# Altium schematic sheet 2_PMIC.schdoc
size 431 x 309 mm; Symbol: Sheet-Symbol_A4; Device: Sheet-Symbol_A4; Company: 嘉立创EDA; Version: V1.0; Page Size: A4; @Project Name: RK3568核心板; @Page Count: 14; @Update Date: 2024-10-11; @Create Date: 2024-10-08; @Schematic Name: Schematic1; @Page No: 2; @Page Name: PMIC; @Board Name: Board1; @Create Time: 10:48:32; @Update Time: 10:49:04; Width: 1655; Height: 1170; Region Start: 1; X Region Count: 6; Y Region Count: 4; Blade Width: 10; Title Block Position: 3
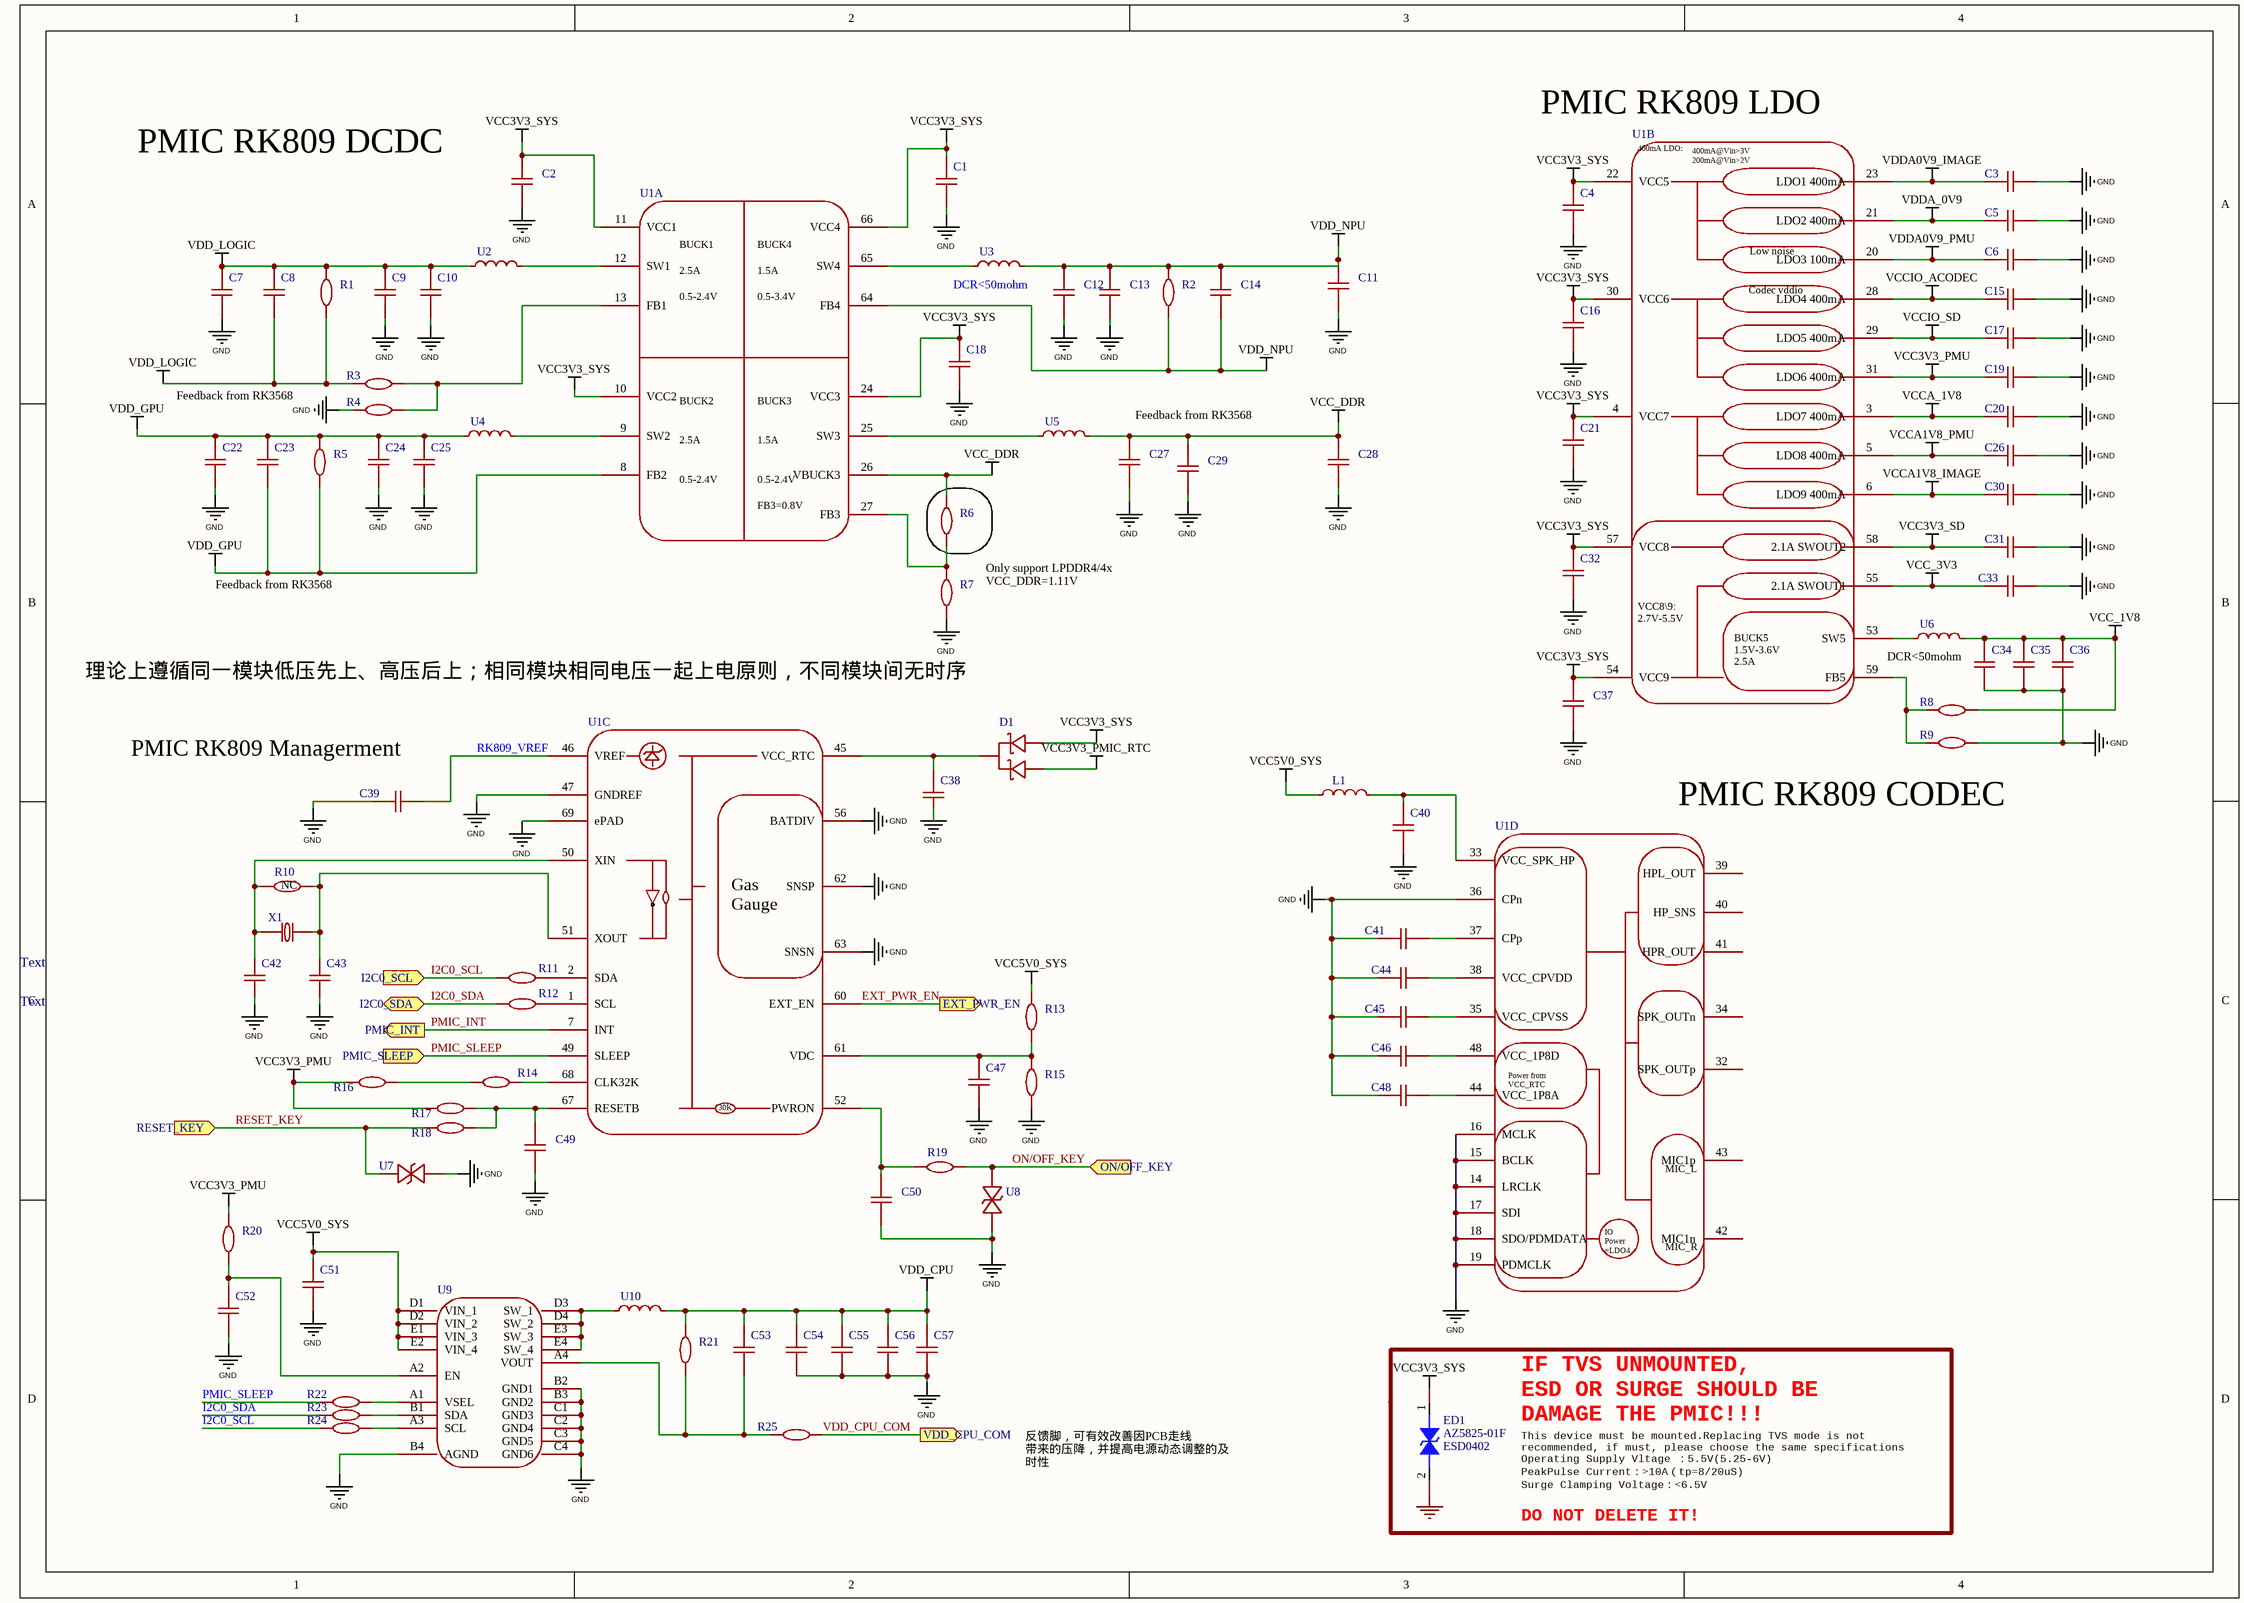
[diagram p0: 2_PMIC.schdoc]

## Parts
C1  10uF  [C0402]  (value not drawn)
C2  22uF  [C0603]  (value not drawn)
C3  1uF  [C0402]  (value not drawn)
C4  1uF  [C0402]  (value not drawn)
C5  1uF  [C0402]  (value not drawn)
C6  1uF  [C0402]  (value not drawn)
C7  10uF  [C0402]  (value not drawn)
C8  100nF  [C0402]  (value not drawn)
C9  22uF  [C0603]  (value not drawn)
C10  10uF  [C0402]  (value not drawn)
C11  10uF  [C0402]  (value not drawn)
C12  22uF  [C0603]  (value not drawn)
C13  10uF  [C0402]  (value not drawn)
C14  100nF  [C0402]  (value not drawn)
C15  1uF  [C0402]  (value not drawn)
C16  1uF  [C0402]  (value not drawn)
C17  1uF  [C0402]  (value not drawn)
C18  10uF  [C0402]  (value not drawn)
C19  1uF  [C0402]  (value not drawn)
C20  1uF  [C0402]  (value not drawn)
C21  1uF  [C0402]  (value not drawn)
C22  10uF  [C0402]  (value not drawn)
C23  100nF  [C0402]  (value not drawn)
C24  22uF  [C0603]  (value not drawn)
C25  10uF  [C0402]  (value not drawn)
C26  1uF  [C0402]  (value not drawn)
C27  22uF  [C0603]  (value not drawn)
C28  10uF  [C0402]  (value not drawn)
C29  10uF  [C0402]  (value not drawn)
C30  1uF  [C0402]  (value not drawn)
C31  1uF  [C0402]  (value not drawn)
C32  1uF  [C0402]  (value not drawn)
C33  10uF  [C0402]  (value not drawn)
C34  22uF  [C0603]  (value not drawn)
C35  22uF  [C0603]  (value not drawn)
C36  10uF  [C0402]  (value not drawn)
C37  10uF  [C0402]  (value not drawn)
C38  100nF  [C0402]  (value not drawn)
C39  1uF  [C0402]  (value not drawn)
C40  10uF  [C0402]  (value not drawn)
C41  2.2uF  [C0402]  (value not drawn)
C42  18pF  [C0402]  (value not drawn)
C43  18pF  [C0402]  (value not drawn)
C44  1uF  [C0402]  (value not drawn)
C45  2.2uF  [C0402]  (value not drawn)
C46  1uF  [C0402]  (value not drawn)
C47  100nF  [C0402]  (value not drawn)
C48  1uF  [C0402]  (value not drawn)
C49  100nF  [C0402]  (value not drawn)
C50  100nF  [C0402]  (value not drawn)
C51  22uF  [C0603]  (value not drawn)
C52  100nF  [C0402]  (value not drawn)
C53  100nF  [C0402]  (value not drawn)
C54  47uF  [C0805]  (value not drawn)
C55  22uF  [C0603]  (value not drawn)
C56  22uF  [C0603]  (value not drawn)
C57  22uF  [C0603]  (value not drawn)
D1  BAT54C,215  [SOT-23-3_L2.9-W1.6-P1.90-LS2.8-BR]  (value not drawn)
ED1  AZ5825-01F  [ESD0402]
L1  120R 100MHz  [L0603]  (value not drawn)
R1  100Ω  [R0402]  (value not drawn)
R2  100Ω  [R0402]  (value not drawn)
R3  560Ω  [R0402]  (value not drawn)
R4  9.1kΩ  [R0402]  (value not drawn)
R5  100Ω  [R0402]  (value not drawn)
R6  47kΩ  [R0402]  (value not drawn)
R7  120kΩ  [R0402]  (value not drawn)
R8  0Ω  [R0402]  (value not drawn)
R9  NC  [R0402]  (value not drawn)
R10  1MΩ  [R0402]  (value not drawn)
R11  22Ω  [R0402]  (value not drawn)
R12  22Ω  [R0402]  (value not drawn)
R13  180kΩ  [R0402]  (value not drawn)
R14  NC  [R0402]  (value not drawn)
R15  56kΩ  [R0402]  (value not drawn)
R16  10kΩ  [R0402]  (value not drawn)
R17  10kΩ  [R0402]  (value not drawn)
R18  22Ω  [R0402]  (value not drawn)
R19  100Ω  [R0402]  (value not drawn)
R20  51kΩ  [R0402]  (value not drawn)
R21  100Ω  [R0402]  (value not drawn)
R22  22Ω  [R0402]  (value not drawn)
R23  22Ω  [R0402]  (value not drawn)
R24  22Ω  [R0402]  (value not drawn)
R25  0Ω  [R0402]  (value not drawn)
U1  RK809-5  [RK809]  (value not drawn)  (parts A,B,C,D of 4)
U2  470nH  [IND-SMD_L2.0-W1.6]  (value not drawn)
U3  470nH  [IND-SMD_L2.0-W1.6]  (value not drawn)
U4  470nH  [IND-SMD_L2.0-W1.6]  (value not drawn)
U5  470nH  [IND-SMD_L2.0-W1.6]  (value not drawn)
U6  470nH  [IND-SMD_L2.0-W1.6]  (value not drawn)
U7  PESD3V3L1BA  [SOD-323_L1.7-W1.3-LS2.6-BI]  (value not drawn)
U8  PESD3V3L1BA  [SOD-323_L1.7-W1.3-LS2.6-BI]  (value not drawn)
U9  TCS4525  [TCS4525]  (value not drawn)
U10  240nH  [IND-SMD_L2.5-W2.0_MHCHL2520]  (value not drawn)
X1  32.768kHz  [FC-135R_L3.2-W1.5]  (value not drawn)

## Blocks framed on the sheet
DO NOT DELETE IT!: ED1

## Ports
EXT_PWR_EN (out), I2C0_SCL (in), I2C0_SDA (bidir), ON/OFF_KEY (in), PMIC_INT (out), PMIC_SLEEP (in), RESET_KEY (in), VDD_CPU_COM (out)

## Nets
GND: C1.1 C2.1 C3.2 C4.1 C5.2 C6.2 C7.1 C9.1 C10.1 C11.1 C12.1 C13.1 C15.2 C16.1 C17.2 C18.1 C19.2 C20.2 C21.1 C22.1 C24.1 C25.1 C26.2 C27.1 C28.1 C29.1 C30.2 C31.2 C32.1 C33.1 C34.1 C35.1 C36.1 C37.1 C38.1 C39.1 C40.1 C41.2 C42.1 C43.1 C44.1 C45.2 C46.1 C47.2 C48.1 C49.1 C50.2 C51.1 C52.1 C54.1 C55.1 C56.1 C57.1 ED1.2 R4.1 R7.1 R9.2 R15.2 U1.14(LRCLK) U1.15(BCLK) U1.16(MCLK) U1.17(SDI) U1.18(SDO/PDMDATA) U1.19(PDMCLK) U1.36(CPn) U1.47(GNDREF) U1.56(BATDIV) U1.62(SNSP) U1.63(SNSN) U1.69(ePAD) U7.2 U8.2 U9.B2(GND1) U9.B3(GND2) U9.B4(AGND) U9.C1(GND3) U9.C2(GND4) U9.C3(GND5) U9.C4(GND6)
VCC3V3_PMIC_RTC: D1.1(A)
VCC3V3_PMU: C19.1 R16.1 R17.1 R20.2 U1.31(LDO6_400mA)
VCC3V3_SD: C31.1 U1.58(2.1A_SWOUT2)
VCC3V3_SYS: C1.2 C2.2 C4.2 C16.2 C18.2 C21.2 C32.2 C37.2 D1.2(A) ED1.1 U1.4(VCC7) U1.10(VCC2) U1.11(VCC1) U1.22(VCC5) U1.24(VCC3) U1.30(VCC6) U1.54(VCC9) U1.57(VCC8) U1.66(VCC4)
VCC5V0_SYS: C51.2 L1.1 R13.2 U9.D1(VIN_1) U9.D2(VIN_2) U9.E1(VIN_3) U9.E2(VIN_4)
VCC_1V8: C34.2 C35.2 C36.2 R8.2 U6.2
VCC_3V3: C33.2 U1.55(2.1A_SWOUT1)
VCC_DDR: C27.2 C28.2 C29.2 R6.2 U1.26(VBUCK3) U5.1
VCCA1V8_IMAGE: C30.1 U1.6(LDO9_400mA)
VCCA1V8_PMU: C26.1 U1.5(LDO8_400mA)
VCCA_1V8: C20.1 U1.3(LDO7_400mA)
VCCIO_ACODEC: C15.1 U1.28(LDO4_400mA)
VCCIO_SD: C17.1 U1.29(LDO5_400mA)
VDD_CPU: C53.2 C54.2 C55.2 C56.2 C57.2 R21.2 U10.2
VDD_GPU: C22.2 C23.1 C23.2 C24.2 C25.2 R5.1 R5.2 U1.8(FB2) U4.1
VDD_LOGIC: C7.2 C8.1 C8.2 C9.2 C10.2 R1.1 R1.2 R3.2 U2.1
VDD_NPU: C11.2 C12.2 C13.2 C14.1 C14.2 R2.1 R2.2 U1.64(FB4) U3.1
VDDA0V9_IMAGE: C3.1 U1.23(LDO1_400mA)
VDDA0V9_PMU: C6.1 U1.20(LDO3_100mA)
VDDA_0V9: C5.1 U1.21(LDO2_400mA)
EXT_PWR_EN: U1.60(EXT_EN) ; port EXT_PWR_EN
I2C0_SCL: R11.2 R24.2 ; port I2C0_SCL
I2C0_SDA: R12.2 R23.2 ; port I2C0_SDA
ON/OFF_KEY: R19.2 U8.1 ; port ON/OFF_KEY
PMIC_INT: U1.7(INT) ; port PMIC_INT
PMIC_SLEEP: R22.2 U1.49(SLEEP) ; port PMIC_SLEEP
RESET_KEY: R18.1 U7.1 ; port RESET_KEY
RK809_VREF: C39.2 U1.46(VREF)
VDD_CPU_COM: R25.2 ; port VDD_CPU_COM
NetC38_2: C38.2 D1.3(K) U1.45(VCC_RTC)
NetC40_2: C40.2 L1.2 U1.33(VCC_SPK_HP)
NetC41_1: C41.1 U1.37(CPp)
NetC42_2: C42.2 R10.1 U1.50(XIN) X1.1
NetC43_2: C43.2 R10.2 U1.51(XOUT) X1.2
NetC44_2: C44.2 U1.38(VCC_CPVDD)
NetC45_1: C45.1 U1.35(VCC_CPVSS)
NetC46_2: C46.2 U1.48(VCC_1P8D)
NetC47_1: C47.1 R13.1 R15.1 U1.61(VDC)
NetC48_2: C48.2 U1.44(VCC_1P8A)
NetC49_2: C49.2 R17.2 R18.2 U1.67(RESETB)
NetC50_1: C50.1 R19.1 U1.52(PWRON)
NetC52_2: C52.2 R20.1 U9.A2(EN)
NetC53_1: C53.1 R21.1 R25.1 U9.A4(VOUT)
NetR3_1: R3.1 R4.2 U1.13(FB1)
NetR6_1: R6.1 R7.2 U1.27(FB3)
NetR8_1: R8.1 R9.1 U1.59(FB5)
NetR11_1: R11.1 U1.2(SDA)
NetR12_1: R12.1 U1.1(SCL)
NetR14_1: R14.1 U1.68(CLK32K)
NetR14_2: R14.2 R16.2
NetR22_1: R22.1 U9.A1(VSEL)
NetR23_1: R23.1 U9.B1(SDA)
NetR24_1: R24.1 U9.A3(SCL)
NetU1_9: U1.9(SW2) U4.2
NetU1_12: U1.12(SW1) U2.2
NetU1_25: U1.25(SW3) U5.2
NetU1_53: U1.53(SW5) U6.1
NetU1_65: U1.65(SW4) U3.2
NetU9_D3: U9.D3(SW_1) U9.D4(SW_2) U9.E3(SW_3) U9.E4(SW_4) U10.1

Not connected (* = marked no-connect by the designer): U1 32(SPK_OUTp) 34(SPK_OUTn) 39(HPL_OUT) 40(HP_SNS) 41(HPR_OUT) 42(MIC1n) 43(MIC1p)

## Notes on the sheet
- PMIC RK809 LDO
- PMIC RK809 DCDC
- (near U3) DCR<50mohm
- Feedback from RK3568
- 理论上遵循同一模块低压先上、高压后上；相同模块相同电压一起上电原则，不同模块间无时序
- Only support LPDDR4/4x
  VCC_DDR=1.11V
- (near U6) DCR<50mohm
- (near C39) PMIC RK809 Managerment
- PMIC RK809 CODEC
- (near R10) NC
- Text
- IF TVS UNMOUNTED,
  ESD OR SURGE SHOULD BE
  DAMAGE THE PMIC!!!
- 反馈脚，可有效改善因PCB走线
  带来的压降，并提高电源动态调整的及时性
- Operating Supply Vltage ：5.5V(5.25-6V)
- PeakPulse Current：>10A（tp=8/20uS)
- Surge Clamping Voltage：<6.5V
- This device must be mounted.Replacing TVS mode is not
  recommended, if must, please choose the same specifications
- 1
- 2
- 3
- 4
- 5
- 6
- A
- B
- C
- D
- 原理图
- Schematic1
- 创建日期
- 更新日期
- 2024-10-11
- 2024-10-08
- 审阅
- 绘制
- 图页
- PMIC
- 物料编码
- RK3568核心板
- 版本
- 尺寸
- 页
- 共
- 14
- V1.0
- A4
- 嘉立创EDA
- (in symbol RK809-5, part A) BUCK1; BUCK4; 2.5A; 1.5A; 0.5-2.4V; 0.5-3.4V; BUCK2; BUCK3; FB3=0.8V
- (in symbol RK809-5, part B) 400mA LDO:; Low noise; 400mA@Vin>3V / 200mA@Vin>2V; Codec vddio; VCC8\9: / 2.7V-5.5V; BUCK5 / 1.5V-3.6V / 2.5A
- (in symbol RK809-5, part C) Gas / Gauge; 30K
- (in symbol RK809-5, part D) MIC_L; Power from / VCC_RTC; MIC_R; IO / Power / =LDO4

## Library data of the parts
C1 C7 C10 C11 C13 C18 C22 C25 C28 C29 C33 C36 C37 C40 = CL05A106MP5NUNC: 容值:10uF;精度:±20%;额定电压:10V;材质(温度系数):X5R;; Manufacturer: SAMSUNG(三星); Symbol: CL05A106MP5NUNC_C315248; Add into BOM: yes; Tolerance: ±20%; Voltage Rated: 10V; Temperature Coefficient: X5R; Device: CL05A106MP5NUNC; LCSC Part Name: 10uF ±20% 10V; Supplier Part: C315248; Manufacturer Part: CL05A106MP5NUNC; Supplier Footprint: 0402; JLCPCB Part Class: 扩展库; Datasheet: https://atta.szlcsc.com/upload/public/pdf/source/20231220/1EF805BAE1520675928CC4638D279E74.pdf; Supplier: LCSC; Convert to PCB: yes; Value: 10uF
C2 = CGA0603X5R226M160JT: 容值:22uF;精度:±20%;额定电压:16V;材质(温度系数):X5R;; Manufacturer: HRE(芯声); Add into BOM: yes; Tolerance: ±20%; Voltage Rated: 16V; Temperature Coefficient: X5R; Symbol: CGA0603X5R226M160JT; Device: CGA0603X5R226M160JT; LCSC Part Name: 22uF ±20% 16V; Supplier Part: C6119868; Manufacturer Part: CGA0603X5R226M160JT; Supplier Footprint: 0603; JLCPCB Part Class: 扩展库; Supplier: LCSC; Convert to PCB: yes; Value: 22uF
C3-C6 C15-C17 C19-C21 C26 C30-C32 C39 C44 C46 C48 = CL05A105KA5NQNC: 容值:1uF;精度:±10%;额定电压:25V;材质(温度系数):X5R;; Manufacturer: SAMSUNG(三星); Add into BOM: yes; Tolerance: ±10%; Voltage Rated: 25V; Temperature Coefficient: X5R; Symbol: CL05A105KA5NQNC; Device: CL05A105KA5NQNC; LCSC Part Name: 1uF ±10% 25V; Supplier Part: C52923; Manufacturer Part: CL05A105KA5NQNC; Supplier Footprint: 0402; JLCPCB Part Class: 基础库; Datasheet: https://atta.szlcsc.com/upload/public/pdf/source/20160218/1457707763339.pdf; Supplier: LCSC; Convert to PCB: yes; Value: 1uF
C8 C14 C23 C38 C47 C49 C50 C52 C53 = CL05B104KB54PNC: 容值:100nF;精度:±10%;额定电压:50V;材质(温度系数):X7R;; Manufacturer: SAMSUNG(三星); Add into BOM: yes; Tolerance: ±10%; Voltage Rated: 50V; Temperature Coefficient: X7R; Symbol: CL05B104KB54PNC; Device: CL05B104KB54PNC; LCSC Part Name: 100nF ±10% 50V; Supplier Part: C307331; Manufacturer Part: CL05B104KB54PNC; Supplier Footprint: 0402; JLCPCB Part Class: 基础库; Datasheet: https://atta.szlcsc.com/upload/public/pdf/source/20160218/1457707763339.pdf; Supplier: LCSC; Convert to PCB: yes; Value: 100nF
C9 C12 C24 C27 C34 C35 C51 C55-C57 = CL10A226MP8NUNE: 容值:22uF;精度:±20%;额定电压:10V;材质(温度系数):X5R;; Manufacturer: SAMSUNG(三星); Add into BOM: yes; Tolerance: ±20%; Voltage Rated: 10V; Temperature Coefficient: X5R; Symbol: CL10A226MP8NUNE; Device: CL10A226MP8NUNE; LCSC Part Name: 22uF ±20% 10V; Supplier Part: C86295; Manufacturer Part: CL10A226MP8NUNE; Supplier Footprint: 0603; JLCPCB Part Class: 扩展库; Datasheet: https://atta.szlcsc.com/upload/public/pdf/source/20160218/1457707763339.pdf; Supplier: LCSC; Convert to PCB: yes; Value: 22uF
C41 C45 = GRM155R61E225KE11D: 容值:2.2uF;精度:±10%;额定电压:25V;材质(温度系数):X5R;; Manufacturer: muRata(村田); Add into BOM: yes; Tolerance: ±10%; Voltage Rated: 25V; Temperature Coefficient: X5R; Symbol: GRM155R61E225KE11D; Device: GRM155R61E225KE11D; LCSC Part Name: 2.2uF ±10% 25V; Supplier Part: C385032; Manufacturer Part: GRM155R61E225KE11D; Supplier Footprint: 0402; JLCPCB Part Class: 扩展库; Datasheet: https://atta.szlcsc.com/upload/public/pdf/source/20190531/C385032_AE390FF415271BC6A7223A7F56F516ED.pdf; Supplier: LCSC; Convert to PCB: yes; Value: 2.2uF
C42 C43 = 0402CG180J500NT: 容值:18pF;精度:±5%;额定电压:50V;材质(温度系数):C0G;; Manufacturer: FH(风华); Add into BOM: yes; Tolerance: ±5%; Voltage Rated: 50V; Temperature Coefficient: C0G; Symbol: 0402CG180J500NT; Device: 0402CG180J500NT; LCSC Part Name: 18pF ±5% 50V; Supplier Part: C1549; Manufacturer Part: 0402CG180J500NT; Supplier Footprint: 0402; JLCPCB Part Class: 基础库; Datasheet: https://atta.szlcsc.com/upload/public/pdf/source/20200305/C486355_26A10D38EF8C2A5C37091D0039909270.pdf; Supplier: LCSC; Convert to PCB: yes; Value: 18pF
C54 = CGA0805X5R476M100MT: 容值:47uF;精度:±20%;额定电压:10V;材质(温度系数):X5R;; Manufacturer: HRE(芯声); Add into BOM: yes; Tolerance: ±20%; Voltage Rated: 10V; Temperature Coefficient: X5R; Symbol: CGA0805X5R476M100MT; Device: CGA0805X5R476M100MT; LCSC Part Name: 47uF ±20% 10V; Supplier Part: C6119904; Manufacturer Part: CGA0805X5R476M100MT; Supplier Footprint: 0805; JLCPCB Part Class: 扩展库; Supplier: LCSC; Convert to PCB: yes; Value: 47uF
D1 = BAT54C,215: 二极管配置:1对共阴极;正向压降(Vf):800mV@100mA;直流反向耐压(Vr):30V;平均整流电流(Io):200mA;; Manufacturer: Nexperia(安世); Add into BOM: yes; Diode Configuration: 1对共阴极; Reverse Voltage (Vr): 30V; Average Rectified Current (Io): 200mA; Reverse Leakage Current (Ir): 2uA@25V; Symbol: BAT54C,215; Device: BAT54C,215; LCSC Part Name: 电压:30V 电流:200mA; Supplier Part: C37704; Manufacturer Part: BAT54C,215; Supplier Footprint: SOT-23; JLCPCB Part Class: 扩展库; Datasheet: https://atta.szlcsc.com/upload/public/pdf/source/20161024/1477288736847.pdf; Supplier: LCSC; Convert to PCB: yes; Forward Voltage (Vf@If): 800mV@100mA
ED1 = DIODE BI_DIR TRIG: Transient Voltage Suppressing Device.Tiny Packge for ESD/Transient Protection; Manufacturer: Amazing（晶焱科技）; Priority: A; PCB Footprint: ESD0402; Created by: JJJ; Manufacturer PN: AZ5825-01F; Part Type: ESD_TVS; RK PN: AZ5825-01F
L1 = BLM18PG121SN1D: 标称阻抗@测试频率:120Ω@100MHz;误差:±25%;直流电阻(RDC):50mΩ;; Manufacturer: muRata(村田); Symbol: BLM18PG121SN1D_C14709; Add into BOM: yes; Tolerance: ±25%; DC Resistance: 50mΩ; Current Rating: 2A; Circuits: 1; Device: BLM18PG121SN1D; LCSC Part Name: 单路 0603磁珠 阻抗120Ω@100MHz; Supplier Part: C14709; Manufacturer Part: 120R 100MHz; Supplier Footprint: 0603; JLCPCB Part Class: 扩展库; Datasheet: https://atta.szlcsc.com/upload/public/pdf/source/20130704/1457706621422.pdf; Supplier: LCSC; Convert to PCB: yes; Impedance @ Frequency: 120Ω@100MHz
R1 R2 R5 R19 R21 = 0402WGF1000TCE: 电阻类型:厚膜电阻;阻值:100Ω;精度:±1%;功率:62.5mW;最大工作电压:50V;温度系数:±200ppm/℃;; Manufacturer: UNI-ROYAL(厚声); Add into BOM: yes; Tolerance: ±1%; Power(Watts): 62.5mW; Overload Voltage (Max): 50V; Symbol: 0402WGF1000TCE; Device: 0402WGF1000TCE; LCSC Part Name: 100Ω ±1% 62.5mW 厚膜电阻; Supplier Part: C25076; Manufacturer Part: 0402WGF1000TCE; Supplier Footprint: 0402; JLCPCB Part Class: 基础库; Datasheet: https://atta.szlcsc.com/upload/public/pdf/source/20200306/C422600_1E6D84923E4A46A82E41ADD87F860B5C.pdf; Supplier: LCSC; Convert to PCB: yes; Type: 厚膜电阻; Value: 100Ω; Temperature Coefficient: ±200ppm/℃; Operating Temperature Range: -55℃~+155℃
R3 = 0402WGF5600TCE: 电阻类型:厚膜电阻;阻值:560Ω;精度:±1%;功率:62.5mW;最大工作电压:50V;温度系数:±100ppm/℃;; Manufacturer: UNI-ROYAL(厚声); Add into BOM: yes; Tolerance: ±1%; Power(Watts): 62.5mW; Overload Voltage (Max): 50V; Symbol: 0402WGF5600TCE; Device: 0402WGF5600TCE; Supplier: LCSC; Manufacturer Part: 0402WGF5600TCE; Supplier Part: C25126; Value: 560Ω; JLCPCB Part Class: 扩展库; LCSC Part Name: 560Ω ±1% 62.5mW 厚膜电阻; Supplier Footprint: 0402; Datasheet: https://atta.szlcsc.com/upload/public/pdf/source/20200306/C422600_1E6D84923E4A46A82E41ADD87F860B5C.pdf; Convert to PCB: yes; Type: 厚膜电阻; Temperature Coefficient: ±100ppm/℃; Operating Temperature Range: -55℃~+155℃
R4 = 0402WGF9101TCE: 电阻类型:厚膜电阻;阻值:9.1kΩ;精度:±1%;功率:62.5mW;最大工作电压:50V;温度系数:±100ppm/℃;; Manufacturer: UNI-ROYAL(厚声); Add into BOM: yes; Tolerance: ±1%; Power(Watts): 62.5mW; Overload Voltage (Max): 50V; Symbol: 0402WGF9101TCE; Device: 0402WGF9101TCE; Supplier: LCSC; Manufacturer Part: 0402WGF9101TCE; Supplier Part: C25926; Value: 9.1kΩ; JLCPCB Part Class: 扩展库; LCSC Part Name: 9.1kΩ ±1% 62.5mW 厚膜电阻; Supplier Footprint: 0402; Datasheet: https://atta.szlcsc.com/upload/public/pdf/source/20200306/C422600_1E6D84923E4A46A82E41ADD87F860B5C.pdf; Convert to PCB: yes; Type: 厚膜电阻; Temperature Coefficient: ±100ppm/℃; Operating Temperature Range: -55℃~+155℃
R6 = 0402WGF4702TCE: 电阻类型:厚膜电阻;阻值:47kΩ;精度:±1%;功率:62.5mW;最大工作电压:50V;温度系数:±100ppm/℃;; Manufacturer: UNI-ROYAL(厚声); Add into BOM: yes; Tolerance: ±1%; Power(Watts): 62.5mW; Overload Voltage (Max): 50V; Symbol: 0402WGF4702TCE; Device: 0402WGF4702TCE; Supplier: LCSC; Manufacturer Part: 0402WGF4702TCE; Supplier Part: C25792; Value: 47kΩ; JLCPCB Part Class: 基础库; LCSC Part Name: 47kΩ ±1% 62.5mW 厚膜电阻; Supplier Footprint: 0402; Datasheet: https://atta.szlcsc.com/upload/public/pdf/source/20200306/C422600_1E6D84923E4A46A82E41ADD87F860B5C.pdf; Convert to PCB: yes; Type: 厚膜电阻; Temperature Coefficient: ±100ppm/℃; Operating Temperature Range: -55℃~+155℃
R7 = 0402WGF1203TCE: 电阻类型:厚膜电阻;阻值:120kΩ;精度:±1%;功率:62.5mW;最大工作电压:50V;温度系数:±100ppm/℃;; Manufacturer: UNI-ROYAL(厚声); Add into BOM: yes; Tolerance: ±1%; Power(Watts): 62.5mW; Overload Voltage (Max): 50V; Symbol: 0402WGF1203TCE; Device: 0402WGF1203TCE; LCSC Part Name: 120kΩ ±1% 62.5mW 厚膜电阻; Supplier Part: C25750; Manufacturer Part: 0402WGF1203TCE; Supplier Footprint: 0402; JLCPCB Part Class: 扩展库; Datasheet: https://atta.szlcsc.com/upload/public/pdf/source/20200306/C422600_1E6D84923E4A46A82E41ADD87F860B5C.pdf; Supplier: LCSC; Convert to PCB: yes; Type: 厚膜电阻; Value: 120kΩ; Temperature Coefficient: ±100ppm/℃; Operating Temperature Range: -55℃~+155℃
R8 R9 R14 R25 = 0402WGF0000TCE: 电阻类型:厚膜电阻;阻值:0Ω;精度:±1%;功率:62.5mW;最大工作电压:50V;温度系数:±800ppm/℃;; Manufacturer: UNI-ROYAL(厚声); Add into BOM: yes; Tolerance: ±1%; Power(Watts): 62.5mW; Overload Voltage (Max): 50V; Symbol: 0402WGF0000TCE; Device: 0402WGF0000TCE; Supplier: LCSC; Manufacturer Part: 0402WGF0000TCE; Supplier Part: C17168; JLCPCB Part Class: 基础库; LCSC Part Name: 0Ω ±1% 62.5mW 厚膜电阻; Supplier Footprint: 0402; Datasheet: https://atta.szlcsc.com/upload/public/pdf/source/20200306/C422600_1E6D84923E4A46A82E41ADD87F860B5C.pdf; Convert to PCB: yes; Type: 厚膜电阻; Temperature Coefficient: ±800ppm/℃; Operating Temperature Range: -55℃~+155℃
  R8 R25: Value: 0Ω
  R9 R14: Value: NC
R10 = 0402WGF1004TCE: 电阻类型:厚膜电阻;阻值:1MΩ;精度:±1%;功率:62.5mW;最大工作电压:50V;温度系数:±100ppm/℃;; Manufacturer: UNI-ROYAL(厚声); Add into BOM: yes; Tolerance: ±1%; Power(Watts): 62.5mW; Overload Voltage (Max): 50V; Symbol: 0402WGF1004TCE; Device: 0402WGF1004TCE; Supplier: LCSC; Manufacturer Part: 0402WGF1004TCE; Supplier Part: C26083; Value: 1MΩ; JLCPCB Part Class: 基础库; LCSC Part Name: 1MΩ ±1% 62.5mW 厚膜电阻; Supplier Footprint: 0402; Datasheet: https://atta.szlcsc.com/upload/public/pdf/source/20200306/C422600_1E6D84923E4A46A82E41ADD87F860B5C.pdf; Convert to PCB: yes; Type: 厚膜电阻; Temperature Coefficient: ±100ppm/℃; Operating Temperature Range: -55℃~+155℃
R11 R12 R18 R22-R24 = 0402WGF220JTCE: 电阻类型:厚膜电阻;阻值:22Ω;精度:±1%;功率:62.5mW;最大工作电压:50V;温度系数:±100ppm/℃;; Manufacturer: UNI-ROYAL(厚声); Add into BOM: yes; Tolerance: ±1%; Power(Watts): 62.5mW; Overload Voltage (Max): 50V; Symbol: 0402WGF220JTCE; Device: 0402WGF220JTCE; Supplier: LCSC; Manufacturer Part: 0402WGF220JTCE; Supplier Part: C25092; Value: 22Ω; JLCPCB Part Class: 基础库; LCSC Part Name: 22Ω ±1% 62.5mW 厚膜电阻; Supplier Footprint: 0402; Datasheet: https://atta.szlcsc.com/upload/public/pdf/source/20200306/C422600_1E6D84923E4A46A82E41ADD87F860B5C.pdf; Convert to PCB: yes; Type: 厚膜电阻; Temperature Coefficient: ±100ppm/℃; Operating Temperature Range: -55℃~+155℃
R13 = 0402WGF1803TCE: 电阻类型:厚膜电阻;阻值:180kΩ;精度:±1%;功率:62.5mW;最大工作电压:50V;温度系数:±100ppm/℃;; Manufacturer: UNI-ROYAL(厚声); Add into BOM: yes; Tolerance: ±1%; Power(Watts): 62.5mW; Overload Voltage (Max): 50V; Symbol: 0402WGF1803TCE; Device: 0402WGF1803TCE; LCSC Part Name: 180kΩ ±1% 62.5mW 厚膜电阻; Supplier Part: C25760; Manufacturer Part: 0402WGF1803TCE; Supplier Footprint: 0402; JLCPCB Part Class: 扩展库; Datasheet: https://atta.szlcsc.com/upload/public/pdf/source/20200306/C422600_1E6D84923E4A46A82E41ADD87F860B5C.pdf; Supplier: LCSC; Convert to PCB: yes; Type: 厚膜电阻; Value: 180kΩ; Temperature Coefficient: ±100ppm/℃; Operating Temperature Range: -55℃~+155℃
R15 = 0402WGF5602TCE: 电阻类型:厚膜电阻;阻值:56kΩ;精度:±1%;功率:62.5mW;最大工作电压:50V;温度系数:±100ppm/℃;; Manufacturer: UNI-ROYAL(厚声); Add into BOM: yes; Tolerance: ±1%; Power(Watts): 62.5mW; Overload Voltage (Max): 50V; Symbol: 0402WGF5602TCE; Device: 0402WGF5602TCE; LCSC Part Name: 56kΩ ±1% 62.5mW 厚膜电阻; Supplier Part: C25796; Manufacturer Part: 0402WGF5602TCE; Supplier Footprint: 0402; JLCPCB Part Class: 扩展库; Datasheet: https://atta.szlcsc.com/upload/public/pdf/source/20200306/C422600_1E6D84923E4A46A82E41ADD87F860B5C.pdf; Supplier: LCSC; Convert to PCB: yes; Type: 厚膜电阻; Value: 56kΩ; Temperature Coefficient: ±100ppm/℃; Operating Temperature Range: -55℃~+155℃
R16 R17 = 0402WGF1002TCE: 电阻类型:厚膜电阻;阻值:10kΩ;精度:±1%;功率:62.5mW;最大工作电压:50V;温度系数:±100ppm/℃;; Manufacturer: UNI-ROYAL(厚声); Add into BOM: yes; Tolerance: ±1%; Power(Watts): 62.5mW; Overload Voltage (Max): 50V; Symbol: 0402WGF1002TCE; Device: 0402WGF1002TCE; LCSC Part Name: 10kΩ ±1% 62.5mW 厚膜电阻; Supplier Part: C25744; Manufacturer Part: 0402WGF1002TCE; Supplier Footprint: 0402; JLCPCB Part Class: 基础库; Datasheet: https://atta.szlcsc.com/upload/public/pdf/source/20200306/C422600_1E6D84923E4A46A82E41ADD87F860B5C.pdf; Supplier: LCSC; Convert to PCB: yes; Type: 厚膜电阻; Value: 10kΩ; Temperature Coefficient: ±100ppm/℃; Operating Temperature Range: -55℃~+155℃
R20 = 0402WGF5102TCE: 电阻类型:厚膜电阻;阻值:51kΩ;精度:±1%;功率:62.5mW;最大工作电压:50V;温度系数:±100ppm/℃;; Manufacturer: UNI-ROYAL(厚声); Add into BOM: yes; Tolerance: ±1%; Power(Watts): 62.5mW; Overload Voltage (Max): 50V; Symbol: 0402WGF5102TCE; Device: 0402WGF5102TCE; Supplier: LCSC; Manufacturer Part: 0402WGF5102TCE; Supplier Part: C25794; Value: 51kΩ; JLCPCB Part Class: 基础库; LCSC Part Name: 51kΩ ±1% 62.5mW 厚膜电阻; Supplier Footprint: 0402; Datasheet: https://atta.szlcsc.com/upload/public/pdf/source/20200306/C422600_1E6D84923E4A46A82E41ADD87F860B5C.pdf; Convert to PCB: yes; Type: 厚膜电阻; Temperature Coefficient: ±100ppm/℃; Operating Temperature Range: -55℃~+155℃
U1 = RK809-5: 生命周期: 量产; 规格书: RK809_V1.7.pdf; 类别: 电源管理-PMU; 品牌: 瑞芯微; 条码: EBF29110050; 规格: DC-DC电源芯片 可输出电流 1.5/2.5A 输入电压：2.7V~5.5V 最大输出电压：0.5-3.6V 5路输出; PCB Footprint: qfn68_7r00x7r00x0r80; Add into BOM: yes; Relevance: []; Symbol: RK809-5; Device: RK809-5; 规格编号: RK809-5; Origin Footprint 2: qfn68_7r00x7r00x0r80; Convert to PCB: yes
U2-U6 = FTC201610SR47MBCA: 电感值:470nH;精度:±20%;额定电流:5.5A;饱和电流(Isat):6.3A;类型:一体成型电感;; Manufacturer: cjiang(长江微电); Add into BOM: yes; Tolerance: ±20%; Rated Current: 5.5A; Saturation Current (Isat): 6.3A; DC Resistance (DCR): 22mΩ; Symbol: FTC201610SR47MBCA; Device: FTC201610SR47MBCA; LCSC Part Name: 470nH ±20% 6.3A; Supplier Part: C5832340; Manufacturer Part: FTC201610SR47MBCA; Supplier Footprint: SMD,1.6x2mm; JLCPCB Part Class: 扩展库; Datasheet: https://atta.szlcsc.com/upload/public/pdf/source/20230602/8FFEDA9C0247A92A0D4B67554BFE4091.pdf; Supplier: LCSC; Convert to PCB: yes; Value: 470nH; Type: 一体成型电感
U7 U8 = PESD3V3L1BA_C2687129: Manufacturer: UMW(友台半导体); Add into BOM: yes; Symbol: PESD3V3L1BA_C2687129; Device: PESD3V3L1BA_C2687129; LCSC Part Name: PESD3V3L1BA; Supplier Part: C2687129; Manufacturer Part: PESD3V3L1BA; Supplier Footprint: SOD-323; JLCPCB Part Class: 扩展库; Datasheet: https://atta.szlcsc.com/upload/public/pdf/source/20231109/93EB786E66E91E2C792027BF9B7AC5FE.pdf; Supplier: LCSC; Convert to PCB: yes; Type: ESD
U9 = TCS4525: Add into BOM: yes; Symbol: TCS4525; Device: TCS4525; Convert to PCB: yes
U10 = FTC252012SR24MBCA: 电感值:240nH;精度:±20%;额定电流:8A;饱和电流(Isat):9.3A;类型:一体成型电感;; Manufacturer: cjiang(长江微电); Add into BOM: yes; Tolerance: ±20%; Rated Current: 8A; Saturation Current (Isat): 9.3A; DC Resistance (DCR): 10mΩ; Symbol: FTC252012SR24MBCA; Device: FTC252012SR24MBCA; LCSC Part Name: 240nH ±20% 9.3A; Supplier Part: C5832366; Manufacturer Part: FTC252012SR24MBCA; Supplier Footprint: SMD,2x2.5mm; JLCPCB Part Class: 扩展库; Datasheet: https://atta.szlcsc.com/upload/public/pdf/source/20230602/8FFEDA9C0247A92A0D4B67554BFE4091.pdf; Supplier: LCSC; Convert to PCB: yes; Value: 240nH; Type: 一体成型电感
X1 = Q13FC13500004_C32346: 晶振类型:贴片晶振;频率:32.768kHz;常温频差:±20ppm;外接负载电容:12.5pF;; Manufacturer: EPSON(爱普生); Symbol: Q13FC1350000400; Add into BOM: yes; Crystal Type: 贴片晶振; Normal temperature Frequency Tolerance: ±20ppm; External load capacitor: 12.5pF; Equivalent Series Resistance (ESR): 70kΩ; Device: Q13FC13500004_C32346; LCSC Part Name: 32.768kHz ±20ppm 12.5pF; Supplier Part: C32346; Manufacturer Part: Q13FC13500004; Supplier Footprint: SMD3215-2P; JLCPCB Part Class: 基础库; Datasheet: https://atta.szlcsc.com/upload/public/pdf/source/20240418/0E0FF5F0356BA3753F616001439D1416.pdf; Supplier: LCSC; Convert to PCB: yes; Value: 32.768kHz; Operating Temperature: -40℃~+85℃